# Altium project Micro_Grid.PrjPcb
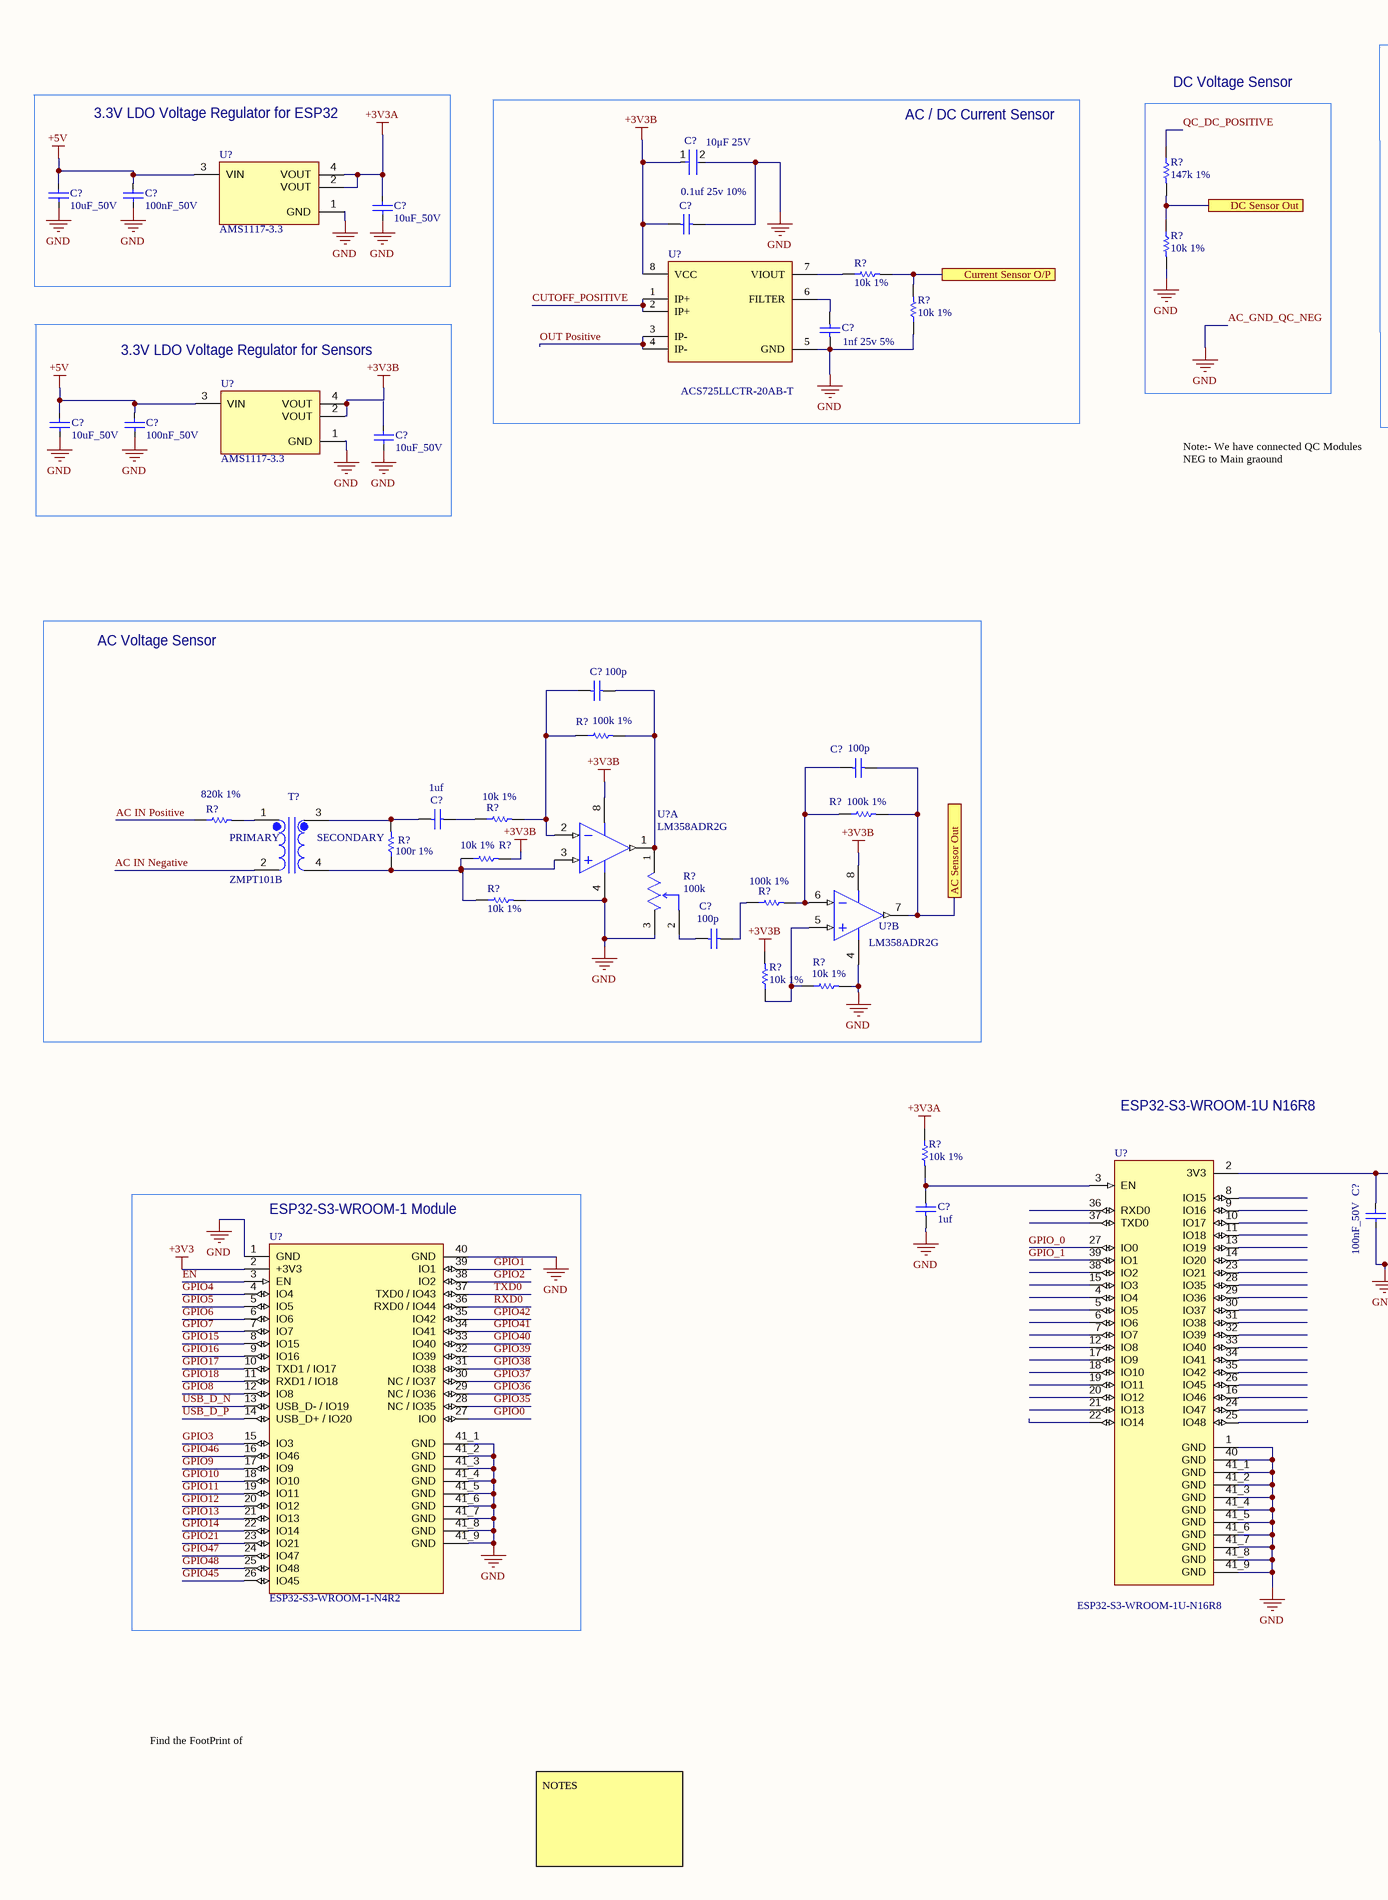
[diagram p0: Micro_Grid_Sch.SchDoc, left]
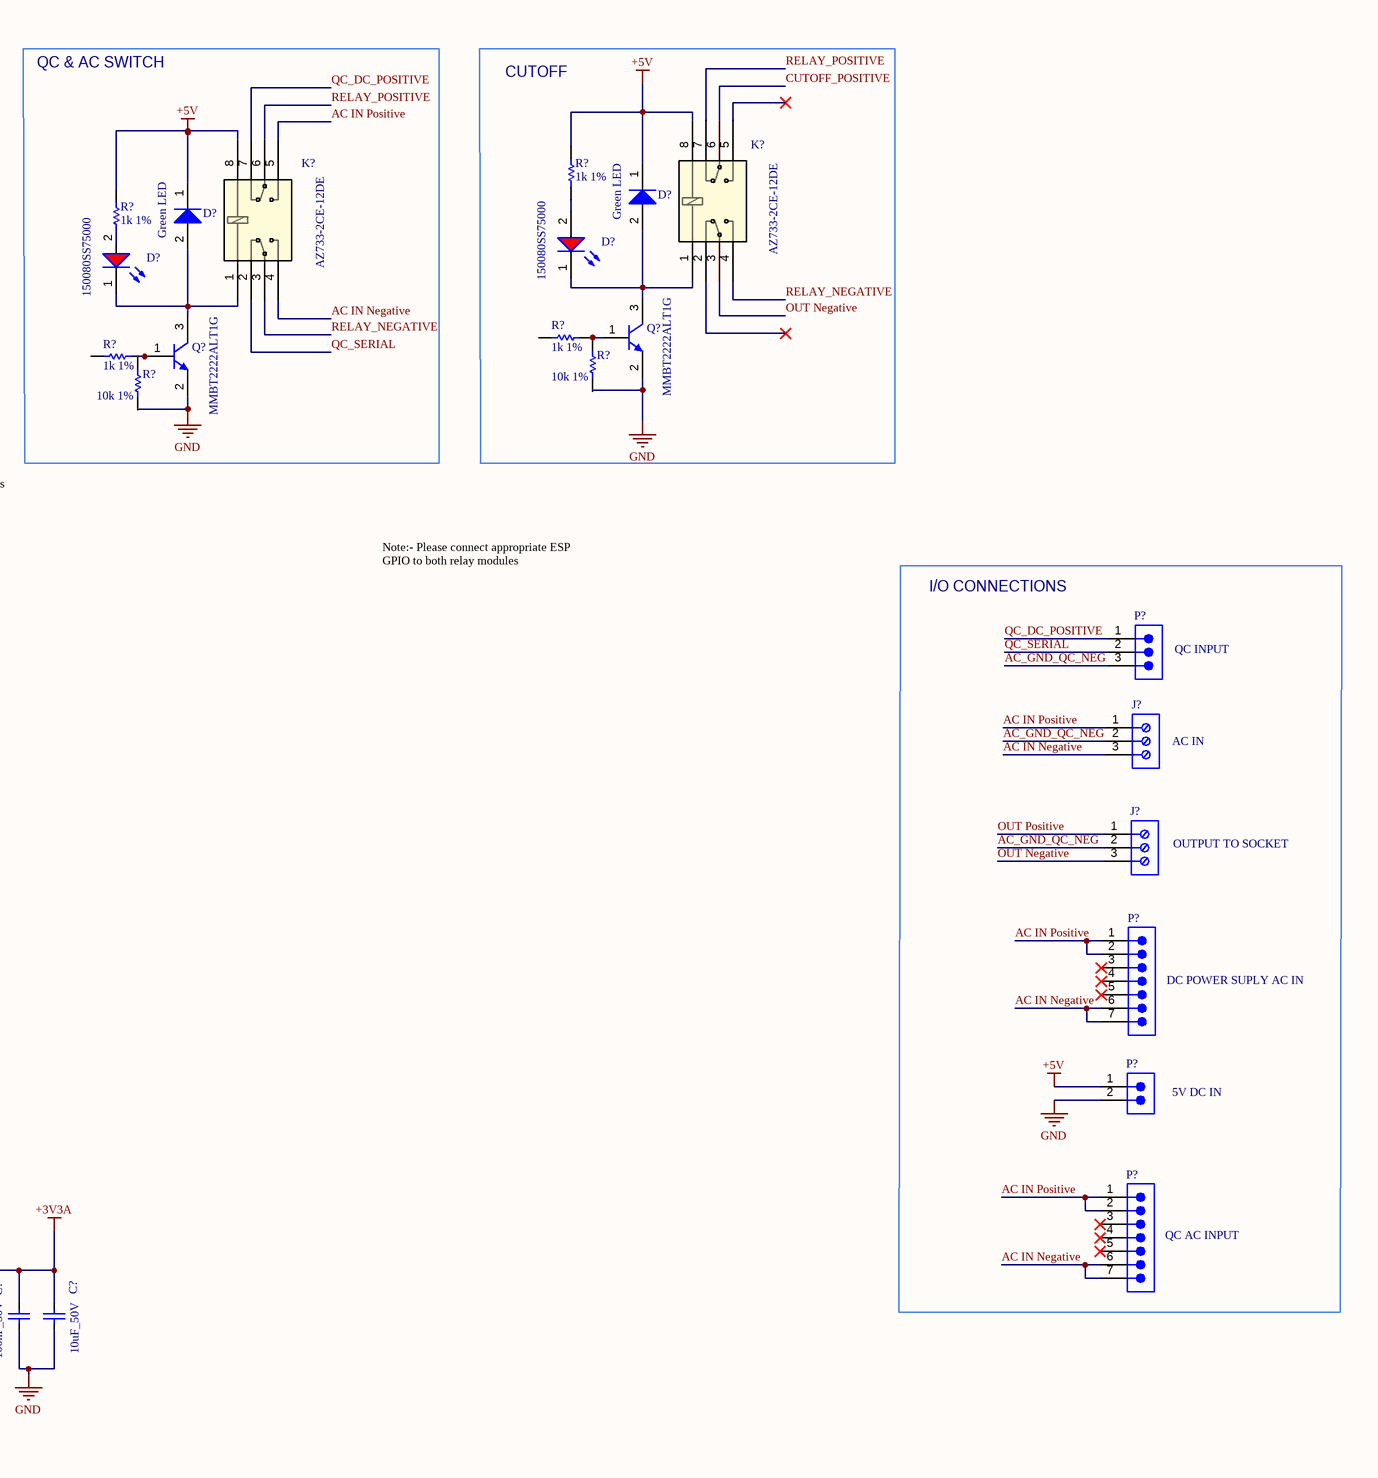
[diagram p1: Micro_Grid_Sch.SchDoc, right]
1 sheet, 60 parts. Net scope: flat (ports and power ports of the same name join across sheets).

## Sheet Micro_Grid_Sch.SchDoc
size 558 x 431 mm; SheetNumber: 1; SheetTotal: 1

### Parts
(Parts that share a designator on the sheet are numbered #1, #2 ... from top to bottom, then left to right.)
C?#1  10μF 25V  [FP-C2012-125-0_2-IPC_B]
C?#2  value 10uF_50V  [C0805]  (hidden comment: C0805C104K5RAC7411)
C?#3  value 100nF_50V  [C0805]  (hidden comment: C0805C104K5RAC7411)
C?#4  value 10uF_50V  [C0805]  (hidden comment: C0805C104K5RAC7411)
C?#5  0.1uf 25v 10%  [CAPC2013X135X50ML15T20]
C?#6  1nf 25v 5%  [CAPC2013X145X50NL20T20]
C?#7  value 10uF_50V  [C0805]  (hidden comment: C0805C104K5RAC7411)
C?#8  value 100nF_50V  [C0805]  (hidden comment: C0805C104K5RAC7411)
C?#9  value 10uF_50V  [C0805]  (hidden comment: C0805C104K5RAC7411)
C?#10  100p  [CAPC2013X140X50NL20T25]
C?#11  100p  [CAPC2013X140X50NL20T25]
C?#12  1uf  [CAPC2013X140X50LL20T25]
C?#13  100p  [CAPC2013X140X50NL20T25]
C?#14  value 10uF_50V  [C0805]  (hidden comment: C0805C104K5RAC7411)
C?#15  1uf  [CAPC2013X140X50LL20T25]
C?#16  value 100nF_50V  [C0805]  (hidden comment: C0805C104K5RAC7411)
D?#1  Green LED  [ONSC-SOD-123-2-425-04_V]
D?#2  150080SS75000  [WL-SMCW_0805_150080xx75000]
D?#3  150080SS75000  [WL-SMCW_0805_150080xx75000]
D?#4  Green LED  [ONSC-SOD-123-2-425-04_V]
J?#1  AC IN  [691214110003]
J?#2  OUTPUT TO SOCKET  [691214110003]
K?#1  AZ733-2CE-12DE  [AZ733-2C_AMZ]
K?#2  AZ733-2CE-12DE  [AZ733-2C_AMZ]
P?#1  QC INPUT  [61300311121]
P?#2  DC POWER SUPLY AC IN  [61300711121]
P?#3  5V DC IN  [61300211121]
P?#4  QC AC INPUT  [61300711121]
Q?#1  MMBT2222ALT1G  [ONSC-SOT-23-3-318-08_V]
Q?#2  MMBT2222ALT1G  [ONSC-SOT-23-3-318-08_V]
R?#1  1k 1%  [RESC2013X60X35ML10T20]
R?#2  147k 1%  [RESC2013X70X40LL20T20]
R?#3  1k 1%  [RESC2013X60X35ML10T20]
R?#4  10k 1%  [RESC2013X60X40NL15T20]
R?#5  10k 1%  [RESC2013X50X30NL20T20]
R?#6  1k 1%  [RESC2013X60X35ML10T20]
R?#7  10k 1%  [RESC2013X50X30NL20T20]
R?#8  1k 1%  [RESC2013X60X35ML10T20]
R?#9  10k 1%  [RESC2013X60X40NL15T20]
R?#10  10k 1%  [RESC2013X60X40NL15T20]
R?#11  100k 1%  [RESC2013X60X30NL20T20]
R?#12  100k 1%  [RESC2013X60X30NL20T20]
R?#13  820k 1%  [RESC2013X70X40ML20T20]
R?#14  10k 1%  [RESC2013X60X40NL15T20]
R?#15  10k 1%  [RESC2013X60X40NL15T20]
R?#16  100k  [FP-TS53YL-MFG]
R?#17  100r 1%  [RESC2013X50X30LL20T20]
R?#18  10k 1%  [RESC2013X60X40NL15T20]
R?#19  100k 1%  [RESC2013X60X30NL20T20]
R?#20  10k 1%  [RESC2013X60X40NL15T20]
R?#21  10k 1%  [RESC2013X60X40NL15T20]
R?#22  10k 1%  [RESC2013X60X40NL15T20]
T?  ZMPT101B  [XFMR_ZMPT101B]
U?#1  AMS1117-3.3  [SOT-223]
U?#2  ACS725LLCTR-20AB-T  [FP-LCN-8-IPC_B]
U?#3  AMS1117-3.3  [SOT-223]
U?#4  LM358ADR2G  [ONSC-SOIC-8-751-07_V]  (part A of 2)
U?#5  LM358ADR2G  [ONSC-SOIC-8-751-07_V]  (part B of 2)
U?#6  ESP32-S3-WROOM-1-N4R2  [ESP32-S3-WROOM-1_NO-KEEPOUT]
U?#7  ESP32-S3-WROOM-1U-N16R8  [XCVR_ESP32-S3-WROOM-1U-N16R8]

### Blocks framed on the sheet
QC & AC SWITCH: D?#3 D?#4 K?#2 Q?#2 R?#3 R?#8 R?#10
CUTOFF: D?#1 D?#2 K?#1 Q?#1 R?#1 R?#6 R?#9
3.3V LDO Voltage Regulator for ESP32: C?#2-C?#4 U?#1
AC / DC Current Sensor: C?#1 C?#5 C?#6 R?#5 R?#7 U?#2
DC Voltage Sensor: R?#2 R?#4
3.3V LDO Voltage Regulator for Sensors: C?#7-C?#9 U?#3
I/O CONNECTIONS: J?#1 J?#2 P?#1-P?#4
AC Voltage Sensor: C?#10-C?#13 R?#11-R?#21 T? U?#4 U?#5
ESP32-S3-WROOM-1 Module: U?#6

### Ports
AC Sensor Out, Current Sensor O/P, DC Sensor Out

### Nets
+3V3: U?#6.2(+3V3)
+3V3A: C?#4.1 C?#14.1 C?#16.2 R?#22.1 U?#1.2(VOUT) U?#1.4(VOUT) U?#7.2(3V3)
+3V3B: C?#1.1 C?#5.1 R?#15.2 R?#21.2 U?#2.8(VCC) U?#3.2(VOUT) U?#3.4(VOUT) U?#4.8(VCC) U?#5.8(VCC)
+5V: C?#2.1 C?#3.1 C?#7.1 C?#8.1 D?#1.1(K) D?#4.1(K) K?#1.8 K?#2.8 P?#3.1 R?#1.1 R?#3.1 U?#1.3(VIN) U?#3.3(VIN)
AC_GND_QC_NEG: C?#1.2 C?#2.2 C?#3.2 C?#4.2 C?#5.2 C?#6.2 C?#7.2 C?#8.2 C?#9.2 C?#14.2 C?#15.1 C?#16.1 J?#1.2 J?#2.2 P?#1.3 P?#3.2 Q?#1.2(E) Q?#2.2(E) R?#4.2 R?#7.1 R?#9.1 R?#10.1 R?#16.3(c) R?#18.2 R?#20.2 U?#1.1(GND) U?#2.5(GND) U?#3.1(GND) U?#4.4(VEE/GND) U?#5.4(VEE/GND) U?#6.1(GND) U?#6.40(GND) U?#6.41_1(GND) U?#6.41_2(GND) U?#6.41_3(GND) U?#6.41_4(GND) U?#6.41_5(GND) U?#6.41_6(GND) U?#6.41_7(GND) U?#6.41_8(GND) U?#6.41_9(GND) U?#7.1(GND) U?#7.40(GND) U?#7.41_1(GND) U?#7.41_2(GND) U?#7.41_3(GND) U?#7.41_4(GND) U?#7.41_5(GND) U?#7.41_6(GND) U?#7.41_7(GND) U?#7.41_8(GND) U?#7.41_9(GND)  [also labelled GND]
AC IN Negative: J?#1.3 K?#2.4 P?#2.6 P?#2.7 P?#4.6 P?#4.7 T?.2
AC IN Positive: J?#1.1 K?#2.5 P?#2.1 P?#2.2 P?#4.1 P?#4.2 R?#13.1
CUTOFF_POSITIVE: K?#1.6 U?#2.1(IP+) U?#2.2(IP+)
EN: U?#6.3(EN)
GPIO0: U?#6.27(IO0)
GPIO1: U?#6.39(IO1)
GPIO2: U?#6.38(IO2)
GPIO3: U?#6.15(IO3)
GPIO4: U?#6.4(IO4)
GPIO5: U?#6.5(IO5)
GPIO6: U?#6.6(IO6)
GPIO7: U?#6.7(IO7)
GPIO8: U?#6.12(IO8)
GPIO9: U?#6.17(IO9)
GPIO10: U?#6.18(IO10)
GPIO11: U?#6.19(IO11)
GPIO12: U?#6.20(IO12)
GPIO13: U?#6.21(IO13)
GPIO14: U?#6.22(IO14)
GPIO15: U?#6.8(IO15)
GPIO16: U?#6.9(IO16)
GPIO17: U?#6.10(TXD1_/_IO17)
GPIO18: U?#6.11(RXD1_/_IO18)
GPIO21: U?#6.23(IO21)
GPIO35: U?#6.28(NC_/_IO35)
GPIO36: U?#6.29(NC_/_IO36)
GPIO37: U?#6.30(NC_/_IO37)
GPIO38: U?#6.31(IO38)
GPIO39: U?#6.32(IO39)
GPIO40: U?#6.33(IO40)
GPIO41: U?#6.34(IO41)
GPIO42: U?#6.35(IO42)
GPIO45: U?#6.26(IO45)
GPIO46: U?#6.16(IO46)
GPIO47: U?#6.24(IO47)
GPIO48: U?#6.25(IO48)
OUT Negative: J?#2.3 K?#1.3
OUT Positive: J?#2.1 U?#2.3(IP-) U?#2.4(IP-)
QC_DC_POSITIVE: K?#2.7 P?#1.1 R?#2.1
QC_SERIAL: K?#2.2 P?#1.2
RELAY_NEGATIVE: K?#1.4 K?#2.3
RELAY_POSITIVE: K?#1.7 K?#2.6
RXD0: U?#6.36(RXD0_/_IO44)
TXD0: U?#6.37(TXD0_/_IO43)
USB_D_N: U?#6.13(USB_D-_/_IO19)
USB_D_P: U?#6.14(USB_D+_/_IO20)
NetC?#6_1: C?#6.1 U?#2.6(FILTER)
NetC?#10_1: C?#10.1 R?#11.1 R?#14.2 U?#4.2(INA-)
NetC?#10_2: C?#10.2 R?#11.2 R?#16.1(a) U?#4.1(OUTA)
NetC?#11_1: C?#11.1 R?#12.1 R?#19.2 U?#5.6(INB-)
NetC?#11_2: C?#11.2 R?#12.2 U?#5.7(OUTB) ; port AC Sensor Out
NetC?#12_1: C?#12.1 R?#17.2 T?.3
NetC?#12_2: C?#12.2 R?#14.1
NetC?#13_1: C?#13.1 R?#16.2(b)
NetC?#13_2: C?#13.2 R?#19.1
NetC?#15_2: C?#15.2 R?#22.2 U?#7.3(EN)
NetD?#1_2: D?#1.2(A) D?#2.1(K) K?#1.1 Q?#1.3(C)
NetD?#2_2: D?#2.2(A) R?#1.2
NetD?#3_1: D?#3.1(K) D?#4.2(A) K?#2.1 Q?#2.3(C)
NetD?#3_2: D?#3.2(A) R?#3.2
NetQ?#1_1: Q?#1.1(B) R?#6.2 R?#9.2
NetQ?#2_1: Q?#2.1(B) R?#8.2 R?#10.2
NetR?#2_2: R?#2.2 R?#4.1 ; port DC Sensor Out
NetR?#5_1: R?#5.1 U?#2.7(VIOUT)
NetR?#5_2: R?#5.2 R?#7.2 ; port Current Sensor O/P
NetR?#13_2: R?#13.2 T?.1
NetR?#15_1: R?#15.1 R?#17.1 R?#18.1 T?.4 U?#4.3(INA+)
NetR?#20_1: R?#20.1 R?#21.1 U?#5.5(INB+)

Not connected (* = marked no-connect by the designer): C?#9 1; K?#1 2* 5*; P?#2 3* 4* 5*; P?#4 3* 4* 5*; R?#6 1; R?#8 1; U?#7 4(IO4) 5(IO5) 6(IO6) 7(IO7) 8(IO15) 9(IO16) 10(IO17) 11(IO18) 12(IO8) 13(IO19) 14(IO20) 15(IO3) 16(IO46) 17(IO9) 18(IO10) 19(IO11) 20(IO12) 21(IO13) 22(IO14) 23(IO21) 24(IO47) 25(IO48) 26(IO45) 27(IO0) 28(IO35) 29(IO36) 30(IO37) 31(IO38) 32(IO39) 33(IO40) 34(IO41) 35(IO42) 36(RXD0) 37(TXD0) 38(IO2) 39(IO1)

### Notes on the sheet
- Note:- We have connected QC Modules NEG to Main graound
- Note:- Please connect appropriate ESP GPIO to both relay modules
- ESP32-S3-WROOM-1U N16R8
- Find the FootPrint of
- NOTES
- Labels drawn without touching a wire or pin: GPIO_0, GPIO_1
- DWG. NO.
- REV.
- SHT.
- REVISION
- DESCRIPTION
- DATE
- APPROVED
- THIS DOCUMENT AND THE DATA DISCLOSED HEREIN OR HEREWITH IS THE PROPERTY OF ALTIUM LIMITED AND MAY BE FREELY DISTRIBUTED IN WHOLE. NO RIGHTS ARE RESERVED OR EXPRESS OR IMPLIED WARANTEE GIVEN.
- ENG:
- DSN:
- APPROVALS
- PROJECT
- DOCUMENT REVISION:
- DESIGN ITEM:
- CHK:
- BOM:
- REFERENCE DOCUMENTS
- PROJECT REVISION:
- TITLE
- FAB DWG:
- PCB DWG:
- ASSY DWG:
- SCALE:
- SIZE
- C
- CAGE CODE
- FILE NAME
- DWG NO.
- SHEET
- OF
- REV
- (in symbol ZMPT101B) PRIMARY; SECONDARY

### Library data of the parts
C?#1 = CMP-08246-002675-1: Multilayer Ceramic Capacitors 10μF ±10% 25V X5R SMD 0805; Capacitance: 10uF; Packaging: Tape and Reel; Dielectric: X5R; Case/Package: 0805; Lead Free: Lead Free; Dielectric Material: Ceramic; Series: C; Termination: SMD/SMT; Voltage: 25V; Depth: 1.25mm; Max Operating Temperature: 85°C; Voltage Rating (DC): 25V; Resistor Type: Ceramic; Weight: 0.000194oz; Case Code (Metric): 2012; Height: 1.25mm; Mount: Surface Mount; Voltage Rating: 25V; Length: 2mm; REACH SVHC: No SVHC; Min Operating Temperature: -55°C; Case Code (Imperial): 0805; Thickness: 0.057inch; Width: 0.049inch; Tolerance: 10%; Package Quantity: 1
C?#2-C?#4 C?#7-C?#9 C?#14 C?#16 = CAPACITOR: C0805 0.10 μF X7R 30ppm/°C 10.00% 50 V; Manufacturer: KEMET; Material: Ceramic; Tolerance: 0.1; Capacitance: 100nF; Voltage Rating: 50 V; Temperature: -55°C to +125°C; Device Class L3: Ceramic Capacitors; Temperature Characteristic: X7R; Device Class L1: Passive Components; Category: Cap; Temperature Coefficient: 30ppm/°C; Manufacturer Part Number: C0805C104K5RAC7411; Temperature Range High: +125°C; Height: 0.88mm; RoHS: TRUE; ComponentLink2Description: Datasheet; Lead Free: Yes; Package: C0805C-DN; Temperature Range Low: -55°C; ComponentLink2URL: https://content.kemet.com/datasheets/KEM_C1003_C0G_SMD.pdf; Automotive: No; Ipc Land Pattern Name: CAPC200125X78; Octopart: https://octopart.com/c0805c104k5rac7411-kemet-18508045; Device Class L2: Capacitors
C?#5 = CMP-2007-03442-1: VJ0805Y104KXXCW1BC; Manufacturer: Vitramon; Part Number: VJ0805Y104KXXCW1BC
C?#6 = CMP-2007-01395-1: VJ0805Y102JXXPW1BC; Manufacturer: Vitramon; Part Number: VJ0805Y102JXXPW1BC
C?#10 C?#11 C?#13 = CMP-2007-03324-1: C0805C101KCGACTU; Manufacturer: Kemet; Part Number: C0805C101KCGACTU
C?#12 C?#15 = CMP-2007-03234-1: C0805C105K3RACTU; Manufacturer: Kemet; Part Number: C0805C105K3RACTU
D?#1 D?#4 = CMP-1054-00051-1: SMMSD914T1G, Switching Diode, 2-Pin SOD-123, Pb-Free, Tape and Reel; Manufacturer: On Semiconductor; trr Max (ns): 4; IF Max (A): 0.2; Configuration: Single; ComponentLink2Description: Datasheet; PackageReference: SOD-123-2-425-04; PackageVersion: Rev. G, 10/2009; DatasheetVersion: Rev. 11; ComponentLink3Description: Package Specification; ComponentLink1URL: http://www.onsemi.com/; ComponentLink3URL: http://www.onsemi.com/pub_link/Collateral/425-04.PDF; ComponentLink1Description: Manufacturer URL; ComponentLink2URL: http://www.onsemi.com/pub_link/Collateral/MMSD914T1-D.PDF; Packing: Tape and Reel; Mounting Technology: Surface Mount; PartNumber: SMMSD914T1G; RoHS: TRUE; PackageDescription: 2-Pin SOD, Body 1.6 x 2.69 mm
D?#2 D?#3 = CMP-1426-00010-4: Led, Red, 630 Nm, 1.9 V, 30 Ma, 60 Mcd Rohs Compliant: Yes; Reverse Voltage: 5V; Test Current: 20mA; Forward Current: 100mA; Power Dissipation: 72mW; Peak Wavelength: 645nm; Lens Style: Clear, Rectangular; Viewing Angle: 140°; Forward Voltage: 1.9V; Luminous Intensity: 60mcd; Wavelength: 630nm; Max Junction Temperature (Tj): 95°C; Color: Red; Case/Package: 0805; Length: 2mm; RoHS: Compliant; Max Operating Temperature: 85°C; Min Operating Temperature: -40°C; Case Code (Metric): 2012; Case Code (Imperial): 0805; Dominant Wavelength: 630nm; Max Reverse Voltage (DC): 5V; REACH SVHC: Unknown; Packaging: Tape and Reel; Mount: Surface Mount; Width: 1.25mm; Height: 700µm
J?#1 J?#2 = CMP-1502-02466-2: NexarPartId: 18818289; Number of Levels: 1; Voltage: 300V; Pitch: 3.5052mm; Stripping Length: -6mm; Number of Positions Per Level: 3; Plating: Brass, Steel; Wire/Cable Gauge: 24AWG; Wire Gauge (Min): 16AWG; Current Rating: 10A; Width: 10.9mm; Length: 7.4mm; Housing Material: Nylon; Height: 12.2mm; Min Operating Temperature: -40°C; Contact Plating: Brass, Tin; Packaging: Box; Color: Blue, Green; Number of Contacts: 3; Number of Pins: 3; Voltage Rating: 300V; Termination: Screw; Lead Pitch: 3.5mm; Max Operating Temperature: 105°C; Mount: Through Hole; Contact Material: Brass; RoHS: Compliant; Wire Gauge (Max): 24AWG; Current: 10A; REACH SVHC: Unknown
K?#1 K?#2 = AZ733-2CE-12DE: No Description Available; Mfr_Name: American Zettler; Type: Power Relays; RefDes: RefDes
P?#1 = CMP-1502-01062-3: NexarPartId: 32855521; Current Rating: 3A; Voltage Rating: 250V; Number of Positions: 3; Pitch: 2.54mm; Contact Resistance: 20mΩ; Connector Type: Male Pin; Gender: Male; REACH SVHC: Unknown; Packaging: Bulk; Contact Material: Copper; Min Operating Temperature: -40°C; Number of Rows: 1; Orientation: Vertical; RoHS: Compliant; Contact Plating: Gold; Max Operating Temperature: 105°C; Mount: Through Hole; Height: 8.94mm; Operating Supply Voltage: 250V; Number of Pins: 3; Contact Mating Length: 5.9944mm; Number of Contacts: 3; Color: Black; Lead Free: Lead Free; Lead Pitch: 2.54mm; Termination: Solder
P?#2 P?#4 = CMP-1502-01074-3: NexarPartId: 32855531; Current Rating: 3A; Number of Positions: 7; Connector Type: Male Pin; Gender: Male; Operating Supply Voltage: 250V; Pitch: 2.54mm; Contact Resistance: 20mΩ; Contact Material: Copper; Contact Plating: Gold; Contact Mating Length: 5.9944mm; Mount: Through Hole; Termination: Solder; Number of Pins: 7; Color: Black; Packaging: Bulk; REACH SVHC: Unknown; Orientation: Vertical; Lead Pitch: 2.54mm; RoHS: Compliant; Number of Rows: 1; Number of Contacts: 7
P?#3 = CMP-1712-00002-6: NexarPartId: 20081794; Number of Contacts: 2; Pitch: 2.54mm; Connector Type: Male Pin; Voltage Rating: 250V; Current Rating: 3A; Gender: Male; Contact Resistance: 20mΩ; Height: 8.94mm; Lead Free: Lead Free; Number of Pins: 2; Termination: Through Hole; RoHS: Compliant; Lead Pitch: 2.54mm; REACH SVHC: No SVHC; Housing Material: PBT; Contact Mating Length: 5.9944mm; Min Operating Temperature: -40°C; Orientation: Vertical; Contact Material: Copper; Contact Gender: Male; Max Operating Temperature: 125°C; Number of Rows: 1; Number of Positions: 2; Packaging: Bulk; Contact Plating: Gold; Mount: Through Hole; Color: Black; Operating Supply Voltage: 250V
Q?#1 Q?#2 = CMP-1048-00538-1: General Purpose Transistor, NPN Silicon, 3-Pin SOT-23, Pb-Free, Tape and Reel; Manufacturer: On Semiconductor; fT Min (MHz): 300; IC Continuous (A): 0.6; ComponentLink3URL: http://www.onsemi.cn/pub_link/Collateral/318-08.PDF; PartNumber: MMBT2222ALT1G; RoHS: TRUE; ComponentLink1URL: http://www.onsemi.com/; ComponentLink3Description: Package Specification; ComponentLink2Description: Datasheet; Mounting Technology: Surface Mount; Packing: Tape and Reel; PackageDescription: 3-Pin Small Outline Transistor, Body 2.92 x 1.3 mm, Pitch 0.95 mm; DatasheetVersion: Rev. 10; PackageReference: SOT-23-3-318-08; ComponentLink2URL: http://www.onsemi.cn/pub_link/Collateral/MMBT2222LT1-D.PDF; Polarity: NPN; PackageVersion: Rev. AP, 11/2009; ComponentLink1Description: Manufacturer URL
R?#1 R?#3 R?#6 R?#8 = CMP-2100-03671-1: RC0805FR-071KL Chip Resistor, 1 KOhm, +/- 1%, 125 mW, -55 to 155 degC, 0805 (2012 Metric), RoHS, Tape and Reel; Manufacturer: Yageo; Temperature Coefficient: 100ppm/degreesC; Voltage Rating (DC): 150V; Max Power Dissipation: 125mW; Resistance: 1KOhm; Number of Pins: 2; Number of Terminations: 2; Datasheet URL: http://www.yageo.com/NewPortal/yageodocoutput?fileName=/pdf/R-Chip/PYu-RC_Group_51_RoHS_L_5.pdf; Length: 0.079inch; Package Description: 2-Pin Surface Mounted Device, Body 2 x 1.25 mm; Depth: 1.25mm; Height: 0.024inch; Military Standard: Not; Case/Package: 0805; Package Reference: 0805; RoHSCompliant: true; Lead Free: LeadFree; Packaging: TapeandReel; Package Quantity: 1; Datasheet Version: Rev. 5, 10/2016; Tolerance: 1%; Min Operating Temperature: -55degC; Voltage Rating: 150V; Composition: ThickFilm; Case Code (Imperial): 0805; Power Rating: 125mW; Width: 0.049inch; Case Code (Metric): 2012; Manufacturer URL: http://www.yageo.com/; Max Operating Temperature: 155degC; REACH SVHC: Unknown; Termination: SMD/SMT
R?#2 = CMP-2001-04436-1: ERJ-6ENF1473V; Manufacturer: Panasonic; Part Number: ERJ-6ENF1473V
R?#4 R?#9 R?#10 R?#14 R?#15 R?#18 R?#20-R?#22 = CMP-2001-04472-1: CRCW080510K0FKEAHP; Manufacturer: Vishay Dale; Part Number: CRCW080510K0FKEAHP
R?#5 R?#7 = CMP-2001-04915-1: Manufacturer: Vishay Dale; Part Number: CRCW080510R0FKEA
R?#11 R?#12 R?#19 = CMP-2001-01994-1: RK73H2ATTD1003F; Manufacturer: KOA Speer; Part Number: RK73H2ATTD1003F
R?#13 = CMP-2001-00574-1: ERJ6ENF8203V; Manufacturer: Panasonic; Part Number: ERJ6ENF8203V
R?#16 = CMP-00030-39740690-1: TS53YL104MR10 Resistor Trimmer, Cermet, 100 kOhm, ± 20%, 250 mW, 1 Turn, Single Turn, Surface Mount; Voltage Rating (AC): 200V; Temperature Coefficient: 100ppm/°C; Number of Turns: 1; Voltage Rating: 158V; Resistance: 100kΩ; Power Rating: 250mW; Min Operating Temperature: -55°C; Taper: Linear; RoHS: Compliant; Height: 2.6924mm; Max Operating Temperature: 125°C; REACH SVHC: Unknown; Termination: Gull Wing; Radiation Hardening: No; Lead Free: Lead Free; Length: 5mm; Composition: Cermet; Mount: Surface Mount; Depth: 6.4mm; Military Standard: Not; Voltage Rating (DC): 200V; Tolerance: 20%; Schedule B: 8533400080, 8533400080; Width: 5.0038mm; NexarPartId: 39740690; Max Power Dissipation: 250mW; Packaging: Cut Tape
R?#17 = CMP-2001-04901-1: CRCW0805100RFKEA; Manufacturer: Vishay Dale; Part Number: CRCW0805100RFKEA
T? = ZMPT101B: Current-type Voltage Transformer; MF: Qingxian Zeming Langxi Electronic; SnapEDA_Link: https://www.snapeda.com/parts/ZMPT101B/Qingxian+Zeming+Langxi+Electronic/view-part/?ref=snap; Package: None; MP: ZMPT101B; Check_prices: https://www.snapeda.com/parts/ZMPT101B/Qingxian+Zeming+Langxi+Electronic/view-part/?ref=eda; Price: None; Value: *; Availability: Not in stock
U?#1 U?#3 = LD1117: IC REG LINEAR 3.3V 800MA SOT223; Input Bias Current: 5mA; Output Voltage Accuracy: 1%; Dropout Voltage: 1.1V; Power Dissipation: 12W; Polarity: Positive; Min Input Voltage: 5.3V; Quiescent Current: 10mA; Max Output Current: 1.3A; Output Current: 950mA; Number of Regulators: 1; Max Supply Voltage: 15V; Output Type: Fixed; Output Voltage: 3.3V; Number of Terminals: 4; Min Supply Voltage: 3.3V; Termination: SMD/SMT; Mount: Surface Mount; Max Power Dissipation: 12W; Case/Package: SOT-223; Lead Free: Lead Free; Height: 1.8mm; REACH SVHC: No SVHC; Radiation Hardening: No; Width: 3.5mm; Length: 6.5mm; Packaging: Tape and Reel; Max Input Voltage: 15V; Accuracy: 1%; Weight: 0.01lb; Contact Plating: Tin; Max Operating Temperature: 125°C; Number of Pins: 4; Max Output Voltage: 3.3V; Min Operating Temperature: -40°C; Nominal Output Voltage: 3.3V; Package Quantity: 1; Min Output Voltage: 3.3V; Number of Outputs: 1
U?#2 = CMP-82923-000001-3: SENSOR CURRENT HALL 20A AC/DC; Accuracy: 0.8%; Linearity: 1.5%; Polarity: Bidirectional; Bandwidth: 120kHz; Number of Channels: 1; Sensitivity: 66mV/A; Quiescent Current: 10mA; Response Time: 4us; Max Supply Current: 14mA; Frequency: 120kHz; Min Operating Temperature: -40°C; Max Operating Temperature: 150°C; Case/Package: SOIC; Current Sensing: 20A; Packaging: Tape and Reel; Number of Pins: 8; Mount: Surface Mount; RoHS Compliant: Yes
U?#4 U?#5 = CMP-1310-00289-1: Single Supply Dual Operational Amplifier, 3 to 32 V, 0 to 70 degC, 8-Pin SOIC, Pb-Free, Tape and Reel; Manufacturer: On Semiconductor; VCC Min (V): 3; VCC Max (V): 32; DatasheetVersion: Rev. 27; ComponentLink1URL: http://www.onsemi.com/; PackageVersion: Rev. AK, 02/2011; Packing: Tape and Reel; ComponentLink3URL: http://www.onsemi.com/pub_link/Collateral/751-07.PDF; ComponentLink2URL: http://www.onsemi.cn/pub_link/Collateral/LM358-D.PDF; Mounting Technology: Surface Mount; PackageReference: SOIC-8-751-07; PackageDescription: 8-Pin Small Outline Integrated Circuit, Body 4.9 x 3.9 mm, Pitch 1.27 mm; ComponentLink3Description: Package Specification; ComponentLink2Description: Datasheet; RoHS: TRUE; ComponentLink1Description: Manufacturer URL; PartNumber: LM358ADR2G
U?#6 = ESP32-S3-WROOM-1: Multiprotocol Modules SMD Module, ESP32-S3R8, 3.3V, 8 MB Octal PSRAM Die, 16 MB Quad SPI Flash, PCB Antenna; MPN: ESP32-S3-WROOM-1-N16R2; MF: Espressif Systems; Supplier Link: https://www.digikey.com/en/products/detail/espressif-systems/ESP32-S3-WROOM-1-N16R2/16162644; Package: Module Espressif Systems; Value: *; Digi-Key_Part_Number: 1965-ESP32-S3-WROOM-1-N16R2TR-ND; Check_prices: https://www.snapeda.com/parts/ESP32-WROOM-32/Espressif+Systems/view-part/?ref=eda; SnapEDA_Link: https://www.snapeda.com/parts/ESP32-WROOM-32/Espressif+Systems/view-part/?ref=snap; Price: 3.98; Supplier: Digikey
U?#7 = ESP32-S3-WROOM-1U-N16R8: Bluetooth, WiFi 802.11b/g/n, Bluetooth v5.0 Transceiver Module 2.4GHz Antenna Not Included, U.FL Surface Mount; MF: Espressif Systems; Package: None; Price: None; Value: *; SnapEDA_Link: https://www.snapeda.com/parts/ESP32-S3-WROOM-1U-N16R8/Espressif+Systems/view-part/?ref=snap; MP: ESP32-S3-WROOM-1U-N16R8; Availability: Unavailable; Check_prices: https://www.snapeda.com/parts/ESP32-S3-WROOM-1U-N16R8/Espressif+Systems/view-part/?ref=eda